# EAGLE design Legoduino (EAGLE 6.5.0)
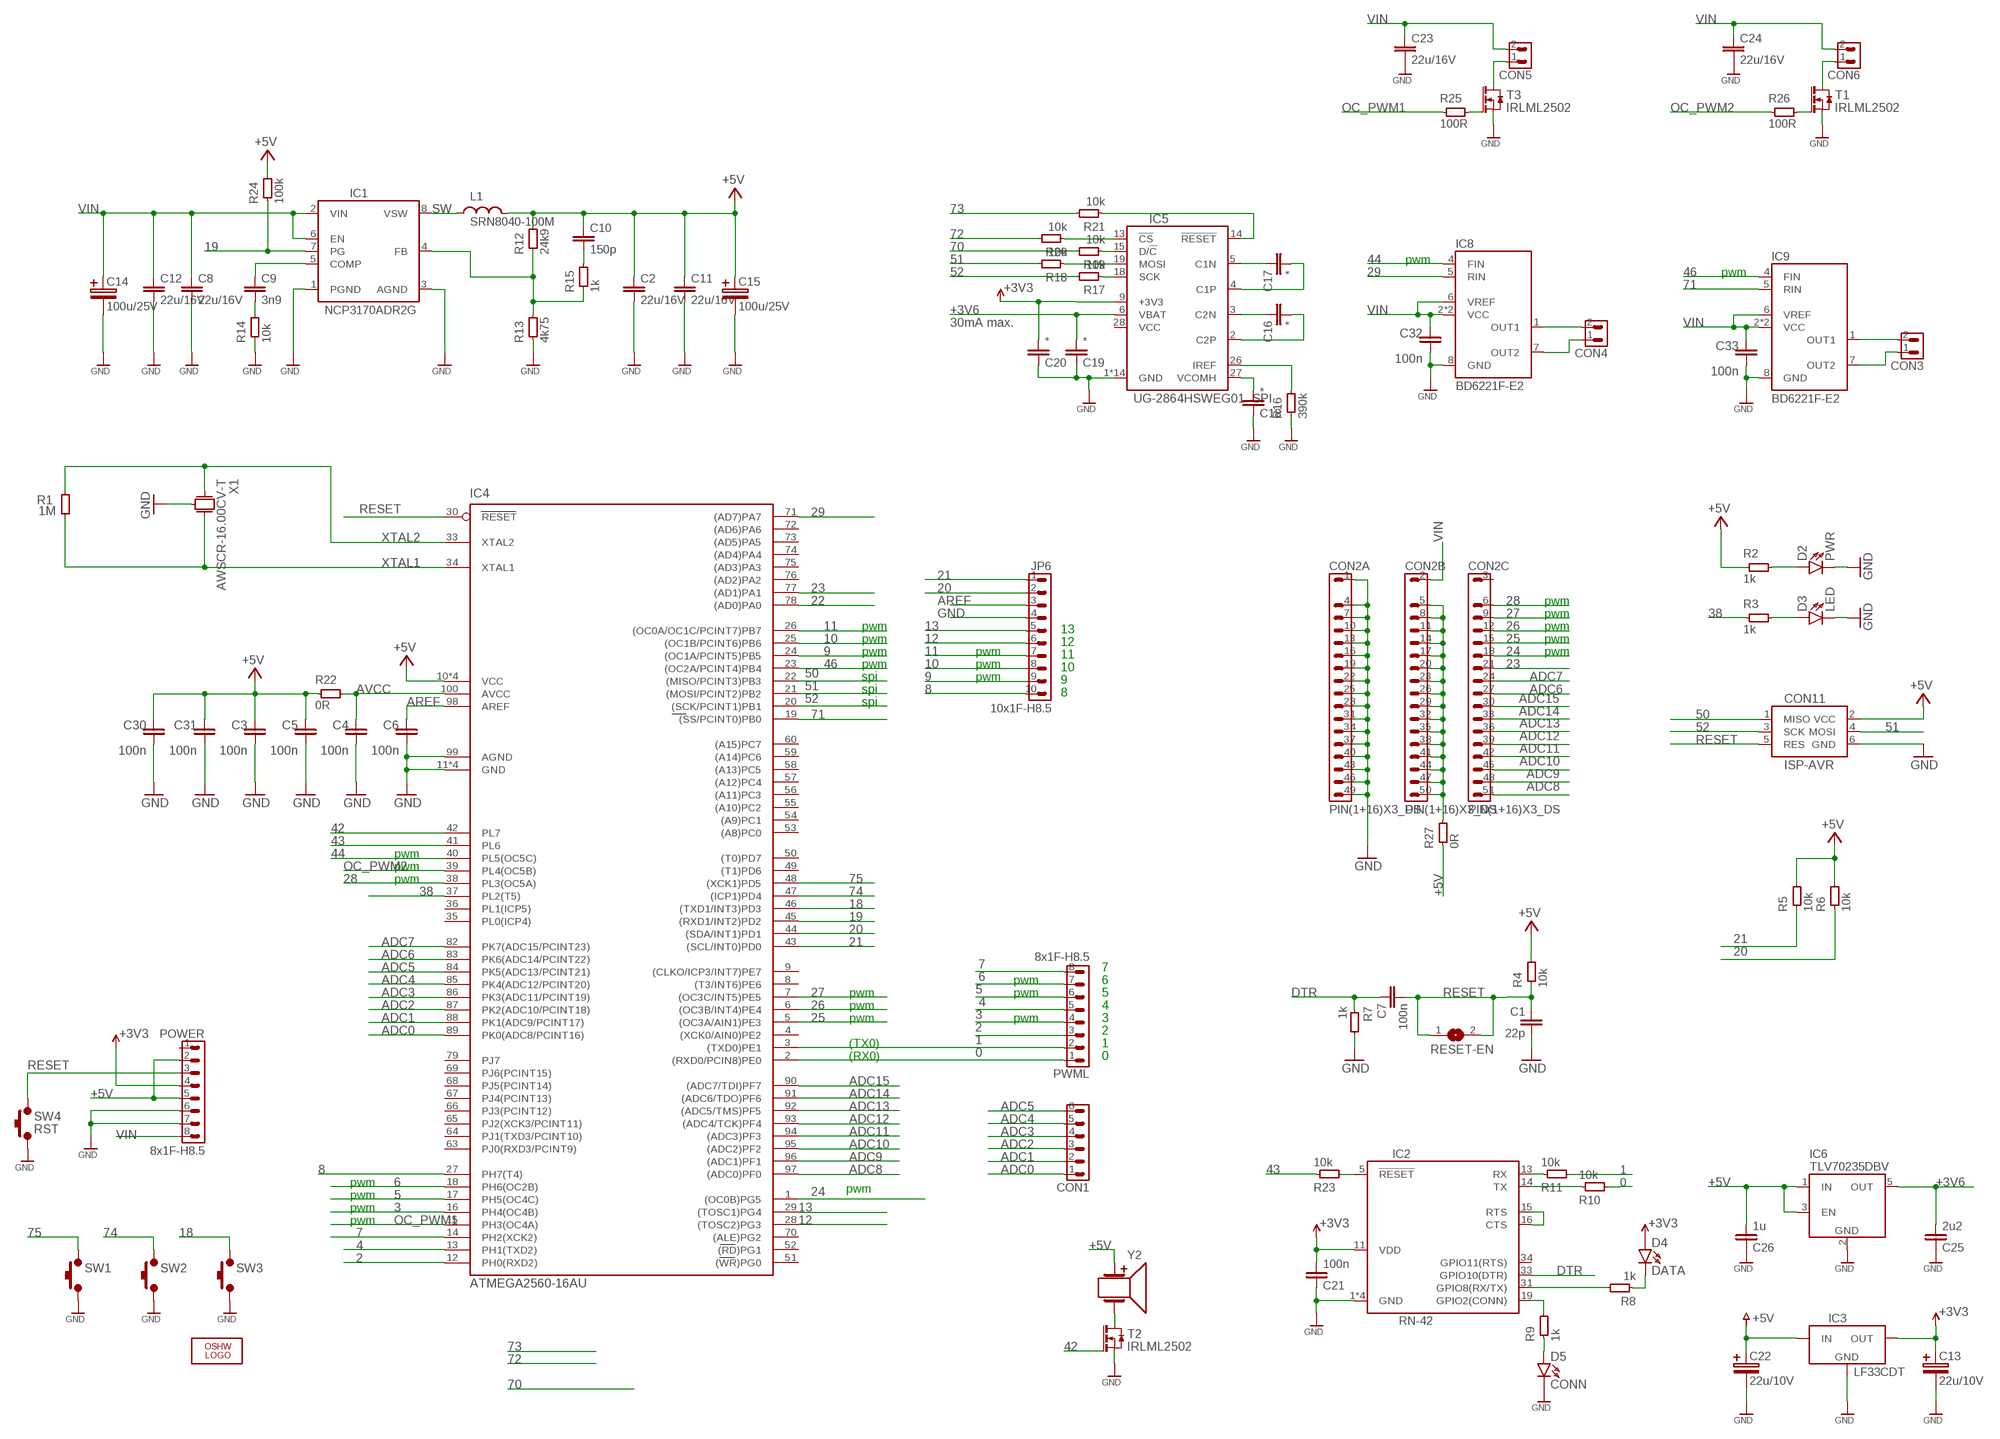
[diagram p0: schematic, sheet 1]

## Parts
C1  22p  C0603  [0603]
C2  22u/16V  C1210  [1210]
C3  100n  C0603  [0603]
C4  100n  C0603  [0603]
C5  100n  C0603  [0603]
C6  100n  C0603  [0603]
C7  100n  C0603  [0603]
C8  22u/16V  C1210  [1210]
C9  3n9  C0603  [0603]
C10  150p  C0603  [0603]
C11  22u/16V  C1210  [1210]
C12  22u/16V  C1210  [1210]
C13  22u/10V  CE-SMC_A  [SMC_A]
C14  100u/25V  CE_SMD6.3  [CE_SMD6.3]
C15  100u/25V  CE_SMD6.3  [CE_SMD6.3]
C16  *  C0603  [0603]
C17  *  C0603  [0603]
C18  *  C0603  [0603]
C19  *  C0603  [0603]
C20  *  C0603  [0603]
C21  100n  C0603  [0603]
C22  22u/10V  CE-SMC_A  [SMC_A]
C23  22u/16V  C1210  [1210]
C24  22u/16V  C1210  [1210]
C25  2u2  C0603  [0603]
C26  1u  C0603  [0603]
C30  100n  C0603  [0603]
C31  100n  C0603  [0603]
C32  100n  C0603  [0603]
C33  100n  C0603  [0603]
CON1  PIN6X1C  [PIN6X1C]
CON2  PIN(1+16)X3_DS  [PIN(1+16)X3_DS]
CON3  PIN2X1C  [PIN2X1C]
CON4  PIN2X1C  [PIN2X1C]
CON5  PIN2X1C  [PIN2X1C]
CON6  PIN2X1C  [PIN2X1C]
CON11  ISP-AVR  [PIN3X2]
D2  PWR  LED0805  [D0805]
D3  LED  LED0805  [D0805]
D4  DATA  LED0805  [D0805]
D5  CONN  LED0805  [D0805]
IC1  NCP3170ADR2G  [SO08]
IC2  RN-42  [RN42]
IC3  LF33CDT  [DPAK]
IC4  ATMEGA2560-16AU  [TQFP100]
IC5  UG-2864HSWEG01_SPI  [UG-2864HSWEG01]
IC6  TLV70235DBV  [SOT23-5]
IC8  BD6221F-E2  [SO08]
IC9  BD6221F-E2  [SO08]
JP6  10x1F-H8.5  PIN10X1C  [PIN10X1C]
L1  SRN8040-100M  [SRN8040]
LOGO1  OSHW_LOGO_10MILX0200-NT  [OSHW_10X200_NOTEXT]
POWER  8x1F-H8.5  PIN8X1C  [PIN8X1C]
PWML  8x1F-H8.5  PIN8X1C  [PIN8X1C]
R1  1M  R0603  [0603]
R2  1k  R0603  [0603]
R3  1k  R0603  [0603]
R4  10k  R0603  [0603]
R5  10k  R0603  [0603]
R6  10k  R0603  [0603]
R7  1k  R0603  [0603]
R8  1k  R0603  [0603]
R9  1k  R0603  [0603]
R10  10k  R0603  [0603]
R11  10k  R0603  [0603]
R12  24k9  R0603  [0603]
R13  4k75  R0603  [0603]
R14  10k  R0603  [0603]
R15  1k  R0603  [0603]
R16  390k  R0603  [0603]
R17  10k  R0603  [0603]
R18  10k  R0603  [0603]
R19  10k  R0603  [0603]
R20  10k  R0603  [0603]
R21  10k  R0603  [0603]
R22  0R  R0603  [0603]
R23  10k  R0603  [0603]
R24  100k  R0603  [0603]
R25  100R  R0603  [0603]
R26  100R  R0603  [0603]
R27  0R  R0805  [0805]
RESET-EN  SJ  [SJ]
SW1  SW_SMD  [MICROSW_SMD]
SW2  SW_SMD  [MICROSW_SMD]
SW3  SW_SMD  [MICROSW_SMD]
SW4  RST  SW_SMD  [MICROSW_SMD]
T1  IRLML2502  [SOT23]
T2  IRLML2502  [SOT23]
T3  IRLML2502  [SOT23]
X1  AWSCR-16.00CV-T  [CERAMIC_3.7X3.1]
Y2  BUZZER-HCM  [BUZZER-HCM]

## Nets
0: IC4.2((RXD0/PCIN8)PE0) PWML.1 R10.2
1: IC4.3((TXD0)PE1) PWML.2 R11.2
2: IC4.12(PH0(RXD2)) PWML.3
3: IC4.16(PH4(OC4B)) PWML.4
4: IC4.13(PH1(TXD2)) PWML.5
5: IC4.17(PH5(OC4C)) PWML.6
6: IC4.18(PH6(OC2B)) PWML.7
7: IC4.14(PH2(XCK2)) PWML.8
8: IC4.27(PH7(T4)) JP6.10
9: IC4.24((OC1A/PCINT5)PB5) JP6.9
10: IC4.25((OC1B/PCINT6)PB6) JP6.8
11: IC4.26((OC0A/OC1C/PCINT7)PB7) JP6.7
12: IC4.28((TOSC2)PG3) JP6.6
13: IC4.29((TOSC1)PG4) JP6.5
18: IC4.46((TXD1/INT3)PD3) SW3.1 SW3.1A
19: IC1.7(PG) IC4.45((RXD1/INT2)PD2) R24.1
20: IC4.44((SDA/INT1)PD1) JP6.2 R6.1
21: IC4.43((SCL/INT0)PD0) JP6.1 R5.1
22: IC4.78((AD0)PA0)
23: CON2.21 IC4.77((AD1)PA1)
24: CON2.18 IC4.1((OC0B)PG5)
25: CON2.15 IC4.5((OC3A/AIN1)PE3)
26: CON2.12 IC4.6((OC3B/INT4)PE4)
27: CON2.9 IC4.7((OC3C/INT5)PE5)
28: CON2.6 IC4.38(PL3(OC5A))
29: IC4.71((AD7)PA7) IC8.5(RIN)
38: IC4.37(PL2(T5)) R3.1
42: IC4.42(PL7) T2.1(G)
43: IC4.41(PL6) R23.1
44: IC4.40(PL5(OC5C)) IC8.4(FIN)
46: IC4.23((OC2A/PCINT4)PB4) IC9.4(FIN)
50: CON11.1(MISO) IC4.22((MISO/PCINT3)PB3)
51: CON11.4(MOSI) IC4.21((MOSI/PCINT2)PB2) R18.2
52: CON11.3(SCK) IC4.20((SCK/PCINT1)PB1) R17.2
70: R19.2
71: IC4.19((SS/PCINT0)PB0) IC9.5(RIN)
72: R20.2
73: R21.2
74: IC4.47((ICP1)PD4) SW2.1 SW2.1A
75: IC4.48((XCK1)PD5) SW1.1 SW1.1A
+3V3: C13.+ C20.2 C21.2 D4.A IC2.11(VDD) IC3.3(OUT) IC5.9(+3V3) POWER.4
+3V6: C19.2 C25.2 IC5.6(VBAT) IC6.5(OUT)
+5V: C2.1 C3.1 C5.1 C10.1 C11.1 C15.+ C22.+ C26.2 C30.1 C31.1 CON11.2(VCC) IC3.1(IN) IC4.10(VCC) IC4.31(VCC) IC4.61(VCC) IC4.80(VCC) IC6.1(IN) IC6.3(EN) L1.2 POWER.2 POWER.5 R2.1 R4.2 R5.2 R6.2 R12.2 R22.1 R24.2 R27.1 Y2.+
+5VP_O: CON2.5 CON2.8 CON2.11 CON2.14 CON2.17 CON2.20 CON2.23 CON2.26 CON2.29 CON2.32 CON2.35 CON2.38 CON2.41 CON2.44 CON2.47 CON2.50 R27.2
ADC0: CON1.1 IC4.89(PK0(ADC8/PCINT16))
ADC1: CON1.2 IC4.88(PK1(ADC9/PCINT17))
ADC2: CON1.3 IC4.87(PK2(ADC10/PCINT18))
ADC3: CON1.4 IC4.86(PK3(ADC11/PCINT19))
ADC4: CON1.5 IC4.85(PK4(ADC12/PCINT20))
ADC5: CON1.6 IC4.84(PK5(ADC13/PCINT21))
ADC6: CON2.27 IC4.83(PK6(ADC14/PCINT22))
ADC7: CON2.24 IC4.82(PK7(ADC15/PCINT23))
ADC8: CON2.51 IC4.97((ADC0)PF0)
ADC9: CON2.48 IC4.96((ADC1)PF1)
ADC10: CON2.45 IC4.95((ADC2)PF2)
ADC11: CON2.42 IC4.94((ADC3)PF3)
ADC12: CON2.39 IC4.93((ADC4/TCK)PF4)
ADC13: CON2.36 IC4.92((ADC5/TMS)PF5)
ADC14: CON2.33 IC4.91((ADC6/TDO)PF6)
ADC15: CON2.30 IC4.90((ADC7/TDI)PF7)
AREF: C6.1 IC4.98(AREF) JP6.3
AVCC: C4.1 IC4.100(AVCC) R22.2
DTR: C7.1 IC2.33(GPIO10(DTR)) R7.1
GND: C1.2 C2.2 C3.2 C4.2 C5.2 C6.2 C8.2 C11.2 C12.2 C13.- C14.- C15.- C18.1 C19.1 C20.1 C21.1 C22.- C23.2 C24.2 C25.1 C26.1 C30.2 C31.2 C32.2 C33.2 CON2.1 CON2.4 CON2.7 CON2.10 CON2.13 CON2.16 CON2.19 CON2.22 CON2.25 CON2.28 CON2.31 CON2.34 CON2.37 CON2.40 CON2.43 CON2.46 CON2.49 CON11.6(GND) D2.K D3.K D5.K IC1.1(PGND) IC1.3(AGND) IC2.1(GND) IC2.12(GND) IC2.28(GND) IC2.29(GND) IC3.2(GND) IC4.11(GND) IC4.32(GND) IC4.62(GND) IC4.81(GND) IC4.99(AGND) IC5.1(GND) IC5.8(GND) IC5.10(GND) IC5.11(GND) IC5.12(GND) IC5.16(GND) IC5.17(GND) IC5.21(GND) IC5.22(GND) IC5.23(GND) IC5.24(GND) IC5.25(GND) IC5.29(GND) IC5.30(GND) IC6.2(GND) IC8.8(GND) IC9.8(GND) JP6.4 POWER.6 POWER.7 R7.2 R13.1 R14.1 R16.1 SW1.2 SW1.2A SW2.2 SW2.2A SW3.2 SW3.2A SW4.2 SW4.2A T1.2(S) T2.2(S) T3.2(S) X1.0
GND1: IC1.4(FB) R12.1 R13.2 R15.1
N$1: IC2.14(TX) R10.1
N$2: D3.A R3.2
N$3: D2.A R2.2
N$4: IC2.13(RX) R11.1
N$5: IC2.31(GPIO8(RX/TX)) R8.2
N$6: D4.K R8.1
N$7: D5.A R9.1
N$8: IC2.19(GPIO2(CONN)) R9.2
N$9: C18.2 IC5.27(VCOMH)
N$10: C9.1 IC1.5(COMP)
N$11: C9.2 R14.2
N$12: IC5.26(IREF) R16.2
N$13: C10.2 R15.2
N$14: C16.1 IC5.3(C2N)
N$15: C17.2 IC5.4(C1P)
N$16: C16.2 IC5.2(C2P)
N$17: C17.1 IC5.5(C1N)
N$18: IC5.13(!CS) R20.1
N$19: IC5.15(D/!C) R19.1
N$20: IC5.18(SCK) R17.1
N$21: IC5.19(MOSI) R18.1
N$22: IC2.15(RTS) IC2.16(CTS)
N$23: IC5.14(!RESET) R21.1
N$24: R25.2 T3.1(G)
N$25: T2.3(D) Y2.-
N$26: CON5.1 T3.3(D)
N$27: IC2.5(!RESET) R23.2
N$28: R26.2 T1.1(G)
N$29: CON3.2 IC9.1(OUT1)
N$30: CON4.2 IC8.1(OUT1)
N$31: CON6.1 T1.3(D)
N$32: CON3.1 IC9.7(OUT2)
N$33: CON4.1 IC8.7(OUT2)
OC_PWM1: IC4.15(PH3(OC4A)) R25.1
OC_PWM2: IC4.39(PL4(OC5B)) R26.1
RESET: C1.1 C7.2 CON11.5(RES) IC4.30(RESET) POWER.3 R4.1 RESET-EN.1 RESET-EN.2 SW4.1 SW4.1A
SW: IC1.8(VSW) L1.1
VIN: C8.1 C12.1 C14.+ C23.1 C24.1 C32.1 C33.1 CON2.2 CON5.2 CON6.2 IC1.2(VIN) IC1.6(EN) IC8.2(VCC) IC8.3(VCC) IC8.6(VREF) IC9.2(VCC) IC9.3(VCC) IC9.6(VREF) POWER.8
XTAL1: IC4.34(XTAL1) R1.1 X1.2
XTAL2: IC4.33(XTAL2) R1.2 X1.1
Unconnected: CON2.3 IC2.34(GPIO11(RTS)) IC4.4((XCK0/AIN0)PE2) IC4.8((T3/INT6)PE6) IC4.9((CLKO/ICP3/INT7)PE7) IC4.35(PL0(ICP4)) IC4.36(PL1(ICP5)) IC4.49((T1)PD6) IC4.50((T0)PD7) IC4.51((WR)PG0) IC4.52((RD)PG1) IC4.53((A8)PC0) IC4.54((A9)PC1) IC4.55((A10)PC2) IC4.56((A11)PC3) IC4.57((A12)PC4) IC4.58((A13)PC5) IC4.59((A14)PC6) IC4.60((A15)PC7) IC4.63(PJ0(RXD3/PCINT9)) IC4.64(PJ1(TXD3/PCINT10)) IC4.65(PJ2(XCK3/PCINT11)) IC4.66(PJ3(PCINT12)) IC4.67(PJ4(PCINT13)) IC4.68(PJ5(PCINT14)) IC4.69(PJ6(PCINT15)) IC4.70((ALE)PG2) IC4.72((AD6)PA6) IC4.73((AD5)PA5) IC4.74((AD4)PA4) IC4.75((AD3)PA3) IC4.76((AD2)PA2) IC4.79(PJ7) POWER.1

## Notes on the sheet
- pwm
- pwm
- 30mA max.
- pwm
- pwm
- pwm | 13 | pwm
- pwm | 12 | pwm
- pwm | pwm | 11 | pwm
- pwm | pwm | 10
- spi | pwm | 9
- spi | 8
- spi
- pwm
- pwm
- pwm
- 7
- pwm | 6
- pwm | pwm | 5
- pwm | 4
- pwm | pwm | 3
- 2
- (TX0) | 1
- (RX0) | 0
- pwm
- pwm
- pwm
- pwm
- pwm

## Power pins joined to a net without a drawn wire
VCC: IC5.28(VCC)

## Library data of the parts
C1-C12 C16-C21 C23-C26 C30-C33 = PN_default:C
C13 C22 = Pietrucha:CE: kondensator elektrolityczny
C14 C15 = PN_default:CE: kondensator elektrolityczny
CON1 = pins:PIN6X1
CON2 = PN_connector:PIN(1+16)X3
CON3-CON6 = pins:PIN2X1
CON11 = Pietrucha:ISP-AVR
D2-D5 = PN_default:LED
IC1 = PN_IC:NCP3170
IC2 = PN_modules:RN-42
IC3 = PN_LDO:LF*: LDO Vin = 2.5-16V Iout = 1A Iq = 1mA max. @ Il=0 1.5V droput max. Needs minimum 2uF (opt. 10uF) Cout with ESR=0.1-10Ohm; VOUT: 3.3V
IC4 = PN_microcontrollers:ATMEGA2560: MICROCONTROLLER 256 Kbytes FLASH 4 Kbytes EEPROM 8 Kbytes SRAM 86 General Purpose I/O pins 12-channels16-bit PWM 4 x Serial USARTs 16-channels 10-bit A/D
IC5 = PN_opto:UG-2864HSWEG01_SPI
IC6 = PN_LDO:TLV702*: LDO Vin = 2-5.5V Iout = 300mA Iq = 2uA max. in shutdown Iq = 55uA max. @ Il=0 375mV droput max. Stable with 2*1uF ceramic capacitors; I_MAX: 300mA; VIN_MAX: 5.5V; VOUT: 3.5V
IC8 IC9 = PN_IC:BD6221
JP6 = pins:PIN10X1
L1 = PN_inductor:SRN8040
LOGO1 = ohw-logo:OSHW_LOGO_10MIL
POWER PWML = pins:PIN8X1
R1-R27 = PN_default:R
RESET-EN = jumper:SJ: SMD solder JUMPER
SW1-SW4 = PN_default:SW
T1-T3 = PN_mosfet:IRLML2502
X1 = PN_quartz:AWSCR: Ceramic resonator
Y2 = Pietrucha:BUZZER

## Board
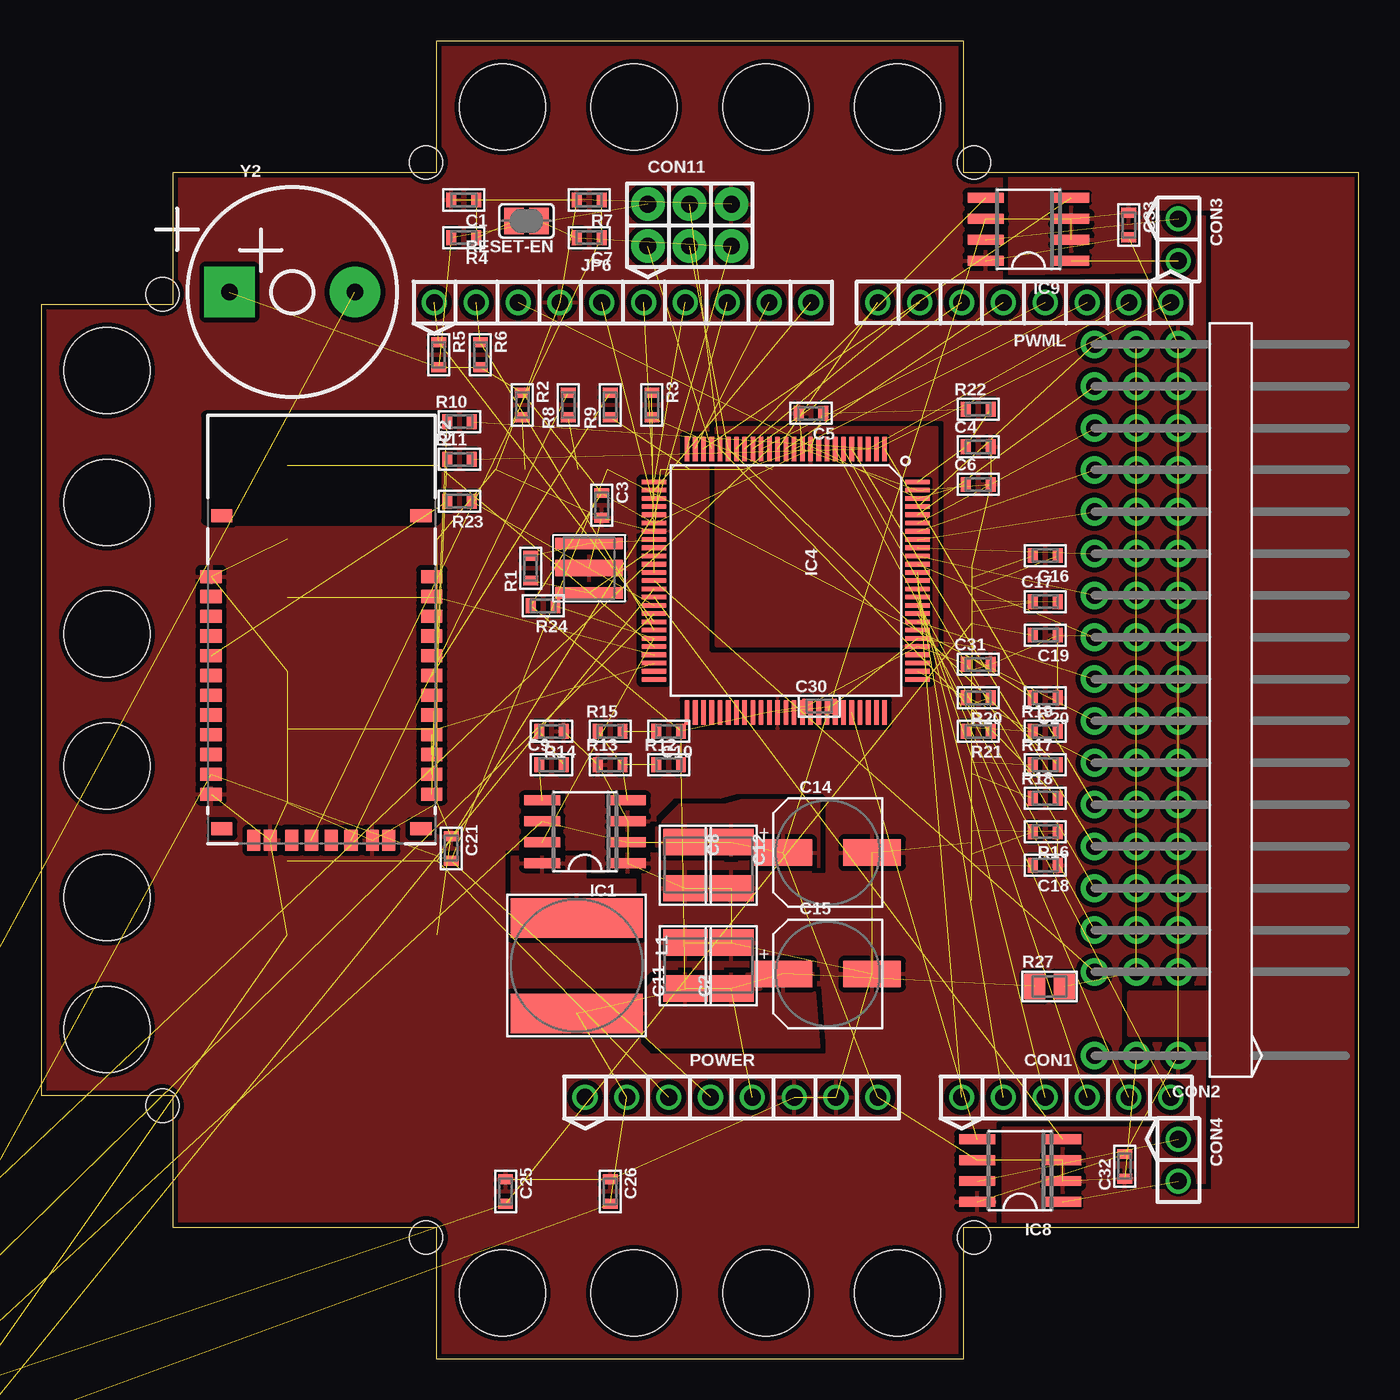
[diagram p1: board, top side]
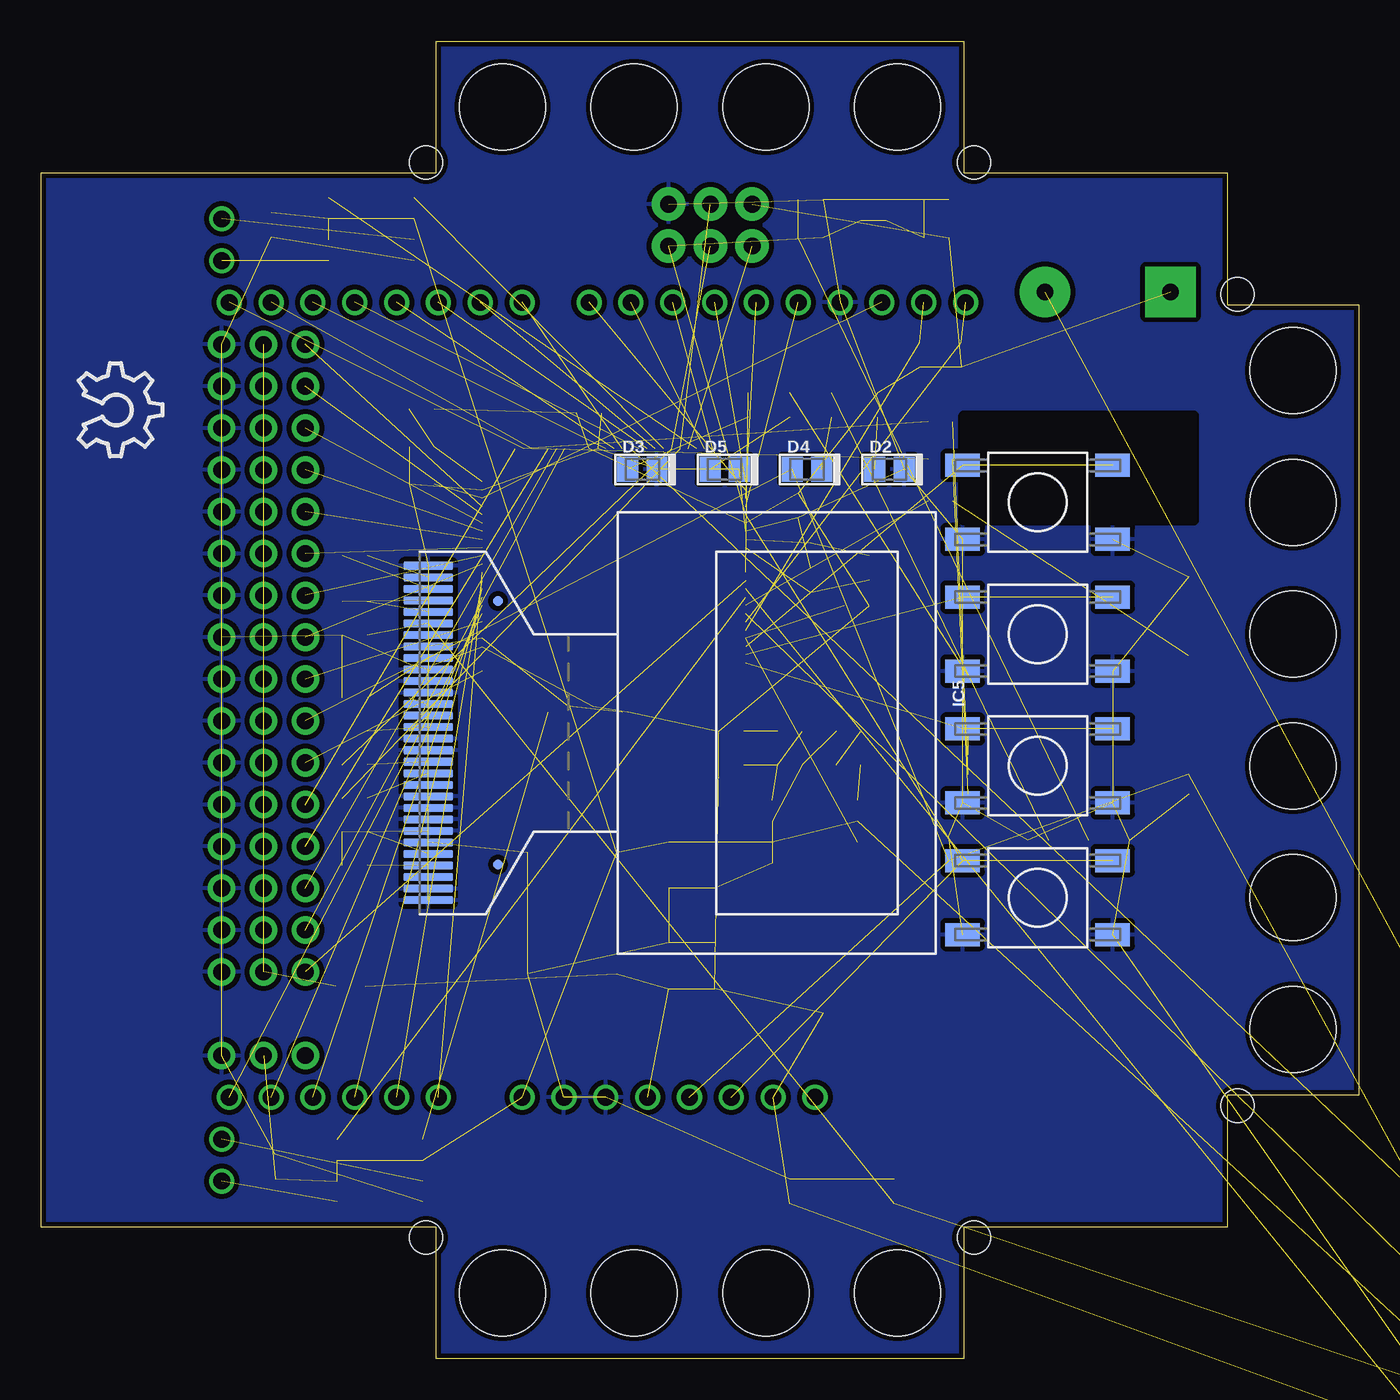
[diagram p2: board, bottom side, seen from below]

Size 80 x 80 mm. Coordinates in mm from the lower left corner, seen from the top.
Outline: 0,16 8,16 8,8 24,8 24,0 56,0 56,8 80,8 80,72 56,72 56,80 24,80 24,72 8,72 8,64 0,64 0,16
Copper layers (1*16): Top 0.035mm / dielectric 1.5mm / Bottom 0.035mm
Design rules "SeeedStudio_v1.1 *": minimum track width 6mil, minimum drill 12mil, track to track 6mil, track to pad 6mil, pad to pad 6mil, via to via 6mil, smd to smd 0mil, copper to edge 10mil, drill to drill 10mil, minimum pad ring 10mil, minimum via ring 6mil, stop-mask expansion 2mil, vias tented up to drill 100mil, thermal gap 12mil
Holes 2 mm at 7.37,64.64 23.36,72.64 56.63,72.64 56.63,7.37 23.36,7.37 7.37,15.37
Holes 5.2 mm at 28,4 36,4 44,4 52,4 4,20 4,28 4,36 4,44 4,52 4,60 28,76 36,76 44,76 52,76
tKeepout: area 24,0 to 56,8; area 24,72 to 56,80
bKeepout: area 24,72 to 56,80; area 24,0 to 56,8

### Footprints (pad centres in the part's own frame; a part is rotated, then mirrored left to right if it is on the bottom)
0603 = smd 0.6 x 0.9: 1 -0.75,0; 2 0.75,0
1210 = smd 1.6 x 2.7: 1 -1.4,0; 2 1.4,0
SMC_A = smd 1.6 x 1.4: + -1.5,0; - 1.5,0
CE_SMD6.3 = smd 3.5 x 1.6: + -2.7,0; - 2.7,0
PIN6X1C = drill 1.016 pad 1.524: 1 -6.35,0; 2 -3.81,0; 3 -1.27,0; 4 1.27,0; 5 3.81,0; 6 6.35,0
PIN(1+16)X3_DS = drill 1.016 pad 1.676: 1 -21.59,-2.54; 2 -21.59,0; 3 -21.59,2.54; 4 -16.51,-2.54; 5 -16.51,0; 6 -16.51,2.54; 7 -13.97,-2.54; 8 -13.97,0; 9 -13.97,2.54; 10 -11.43,-2.54; 11 -11.43,0; 12 -11.43,2.54; 13 -8.89,-2.54; 14 -8.89,0; 15 -8.89,2.54; 16 -6.35,-2.54; 17 -6.35,0; 18 -6.35,2.54; 19 -3.81,-2.54; 20 -3.81,0; 21 -3.81,2.54; 22 -1.27,-2.54; 23 -1.27,0; 24 -1.27,2.54; 25 1.27,-2.54; 26 1.27,0; 27 1.27,2.54; 28 3.81,-2.54; 29 3.81,0; 30 3.81,2.54; 31 6.35,-2.54; 32 6.35,0; 33 6.35,2.54; 34 8.89,-2.54; 35 8.89,0; 36 8.89,2.54; 37 11.43,-2.54; 38 11.43,0; 39 11.43,2.54; 40 13.97,-2.54; 41 13.97,0; 42 13.97,2.54; 43 16.51,-2.54; 44 16.51,0; 45 16.51,2.54; 46 19.05,-2.54; 47 19.05,0; 48 19.05,2.54; 49 21.59,-2.54; 50 21.59,0; 51 21.59,2.54
PIN2X1C = drill 1.016 pad 1.524: 1 -1.27,0; 2 1.27,0
PIN3X2 = drill 1.016 pad 2.032: 1 -2.54,-1.27; 2 -2.54,1.27; 3 0,-1.27; 4 0,1.27; 5 2.54,-1.27; 6 2.54,1.27
D0805 = smd 1.27 x 1.524: A -0.889,0; K 0.889,0
SO08 = smd 0.6 x 2.2: 1 -1.905,-2.6; 2 -0.635,-2.6; 3 0.635,-2.6; 4 1.905,-2.6; 5 1.905,2.6; 6 0.635,2.6; 7 -0.635,2.6; 8 -1.905,2.6
RN42 = smd 0.8 x 1.3: 1 -3.2,-6.7; 2 -2,-6.7; 3 -0.8,-6.7; 4 0.4,-6.7; 5 1.6,-6.7; 6 2.8,-6.7; 7 4,-6.7; 8 5.2,-6.7; 9 6.4,-6.7; 10 7.6,-6.7; 11 8.8,-6.7; 12 10,-6.7; 13 10,6.7; 14 8.8,6.7; 15 7.6,6.7; 16 6.4,6.7; 17 5.2,6.7; 18 4,6.7; 19 2.8,6.7; 20 1.6,6.7; 21 0.4,6.7; 22 -0.8,6.7; 23 -2,6.7; 24 -3.2,6.7; P$1 12.1,6.05; P$10 12.1,-6.05; P$35 -6.9,-6.05; P$36 -6.9,6.05 | smd 1.3 x 0.78: 28 12.8,3.1; 29 12.8,-3.1; 30 12.8,4.1; 35 12.8,-4.1 | smd 1.3 x 0.8: 31 12.8,1.8; 32 12.8,0.6; 33 12.8,-0.6; 34 12.8,-1.8
DPAK = smd 1.6 x 3: 1 -2.3,-3.3; 3 2.3,-3.3 | smd 6.7 x 6.7: 2 0,3.35
TQFP100 = smd 1.5 x 0.28: 1 -8,6; 2 -8,5.5; 3 -8,5; 4 -8,4.5; 5 -8,4; 6 -8,3.5; 7 -8,3; 8 -8,2.5; 9 -8,2; 10 -8,1.5; 11 -8,1; 12 -8,0.5; 13 -8,0; 14 -8,-0.5; 15 -8,-1; 16 -8,-1.5; 17 -8,-2; 18 -8,-2.5; 19 -8,-3; 20 -8,-3.5; 21 -8,-4; 22 -8,-4.5; 23 -8,-5; 24 -8,-5.5; 25 -8,-6; 51 8,-6; 52 8,-5.5; 53 8,-5; 54 8,-4.5; 55 8,-4; 56 8,-3.5; 57 8,-3; 58 8,-2.5; 59 8,-2; 60 8,-1.5; 61 8,-1; 62 8,-0.5; 63 8,0; 64 8,0.5; 65 8,1; 66 8,1.5; 67 8,2; 68 8,2.5; 69 8,3; 70 8,3.5; 71 8,4; 72 8,4.5; 73 8,5; 74 8,5.5; 75 8,6 | smd 0.28 x 1.5: 26 -6,-8; 27 -5.5,-8; 28 -5,-8; 29 -4.5,-8; 30 -4,-8; 31 -3.5,-8; 32 -3,-8; 33 -2.5,-8; 34 -2,-8; 35 -1.5,-8; 36 -1,-8; 37 -0.5,-8; 38 0,-8; 39 0.5,-8; 40 1,-8; 41 1.5,-8; 42 2,-8; 43 2.5,-8; 44 3,-8; 45 3.5,-8; 46 4,-8; 47 4.5,-8; 48 5,-8; 49 5.5,-8; 50 6,-8; 76 6,8; 77 5.5,8; 78 5,8; 79 4.5,8; 80 4,8; 81 3.5,8; 82 3,8; 83 2.5,8; 84 2,8; 85 1.5,8; 86 1,8; 87 0.5,8; 88 0,8; 89 -0.5,8; 90 -1,8; 91 -1.5,8; 92 -2,8; 93 -2.5,8; 94 -3,8; 95 -3.5,8; 96 -4,8; 97 -4.5,8; 98 -5,8; 99 -5.5,8; 100 -6,8
UG-2864HSWEG01 = smd 0.45 x 3: 1 -10.15,-23; 2 -9.45,-23; 3 -8.75,-23; 4 -8.05,-23; 5 -7.35,-23; 6 -6.65,-23; 7 -5.95,-23; 8 -5.25,-23; 9 -4.55,-23; 10 -3.85,-23; 11 -3.15,-23; 12 -2.45,-23; 13 -1.75,-23; 14 -1.05,-23; 15 -0.35,-23; 16 0.35,-23; 17 1.05,-23; 18 1.75,-23; 19 2.45,-23; 20 3.15,-23; 21 3.85,-23; 22 4.55,-23; 23 5.25,-23; 24 5.95,-23; 25 6.65,-23; 26 7.35,-23; 27 8.05,-23; 28 8.75,-23; 29 9.45,-23; 30 10.15,-23 | smd 0.6 x 0.6: ALIGN1 -8,-18.75; ALIGN2 8,-18.75
SOT23-5 = smd 0.7 x 1: 1 -0.95,-1.3; 2 0,-1.3; 3 0.95,-1.3; 4 0.95,1.3; 5 -0.95,1.3
PIN10X1C = drill 1.016 pad 1.524: 1 -11.43,0; 2 -8.89,0; 3 -6.35,0; 4 -3.81,0; 5 -1.27,0; 6 1.27,0; 7 3.81,0; 8 6.35,0; 9 8.89,0; 10 11.43,0
SRN8040 = smd 2.4 x 8: 1 -2.9,0; 2 2.9,0
PIN8X1C = drill 1.016 pad 1.524: 1 -8.89,0; 2 -6.35,0; 3 -3.81,0; 4 -1.27,0; 5 1.27,0; 6 3.81,0; 7 6.35,0; 8 8.89,0
0805 = smd 1.27 x 1.524: 1 -0.889,0; 2 0.889,0
SJ = smd 1.168 x 1.6: 1 -0.762,0; 2 0.762,0
MICROSW_SMD = smd 1.4 x 2.1: 1 -2.25,-4.55; 1A -2.25,4.55; 2 2.25,-4.55; 2A 2.25,4.55
SOT23 = smd 1 x 1.4: 1 -0.95,-1.1; 2 0.95,-1.1; 3 0,1.1
CERAMIC_3.7X3.1 = smd 1 x 4.1: 0 0,0 | smd 0.7 x 4.1: 1 -1.5,0; 2 1.5,0
BUZZER-HCM = drill 1.016 pad 3.048 square: + -3.81,0 | drill 1.016 pad 3.048: - 3.81,0

### Placement (x,y rotation side)
C1  25.65,70.36 180 top
C2  41.91,23.88 90 top
C3  34.04,51.82 270 top
C4  56.9,55.37 0 top
C5  46.74,57.4 180 top
C6  56.9,53.09 0 top
C7  33.27,68.07 180 top
C8  39.12,29.97 270 top
C9  30.99,36.07 0 top
C10  38.1,38.1 180 top
C11  39.12,23.88 90 top
C12  41.91,29.97 270 top
C13  -17.02,-9.65 0 top  (outside the outline)
C14  47.75,30.73 0 top
C15  47.75,23.37 0 top
C16  60.96,48.77 180 top
C17  60.96,45.97 0 top
C18  60.96,29.97 180 top
C19  60.96,43.94 180 top
C20  60.96,40.13 180 top
C21  24.89,30.99 270 top
C22  -17.02,-14.48 0 top  (outside the outline)
C23  -38.35,-22.86 0 top  (outside the outline)
C24  -38.35,-35.56 0 top  (outside the outline)
C25  28.19,10.16 270 top
C26  34.54,10.16 270 top
C30  47.24,39.62 0 top
C31  56.9,42.16 0 top
C32  65.79,11.68 90 top
C33  66.04,68.83 270 top
CON1  62.23,15.88 0 top
CON2  66.5,40 90 top
CON3  69.04,67.94 270 top
CON4  69.04,12.06 270 top
CON5  -32.26,-23.88 0 top  (outside the outline)
CON6  -37.85,-42.42 0 top  (outside the outline)
CON11  39.37,68.83 0 top
D2  28.5,54 0 bottom
D3  43.5,54 0 bottom
D4  33.5,54 0 bottom
D5  38.5,54 0 bottom
IC1  33.02,32 90 top
IC2  17.01,44.29 270 top
IC3  -14.48,-2.29 0 top  (outside the outline)
IC4  45.21,47.24 270 top
IC5  33.5,38 270 bottom
IC6  -6.86,-4.06 0 top  (outside the outline)
IC8  59.44,11.43 90 top
IC9  59.94,68.58 90 top
JP6  35.31,64.14 0 top
L1  32.51,23.88 270 top
LOGO1  77.72,60.45 270 bottom
POWER  41.91,15.88 0 top
PWML  59.69,64.14 180 top
R1  29.72,48.01 90 top
R2  29.21,57.91 270 top
R3  37.08,57.91 270 top
R4  25.65,68.07 180 top
R5  24.13,60.96 270 top
R6  26.67,60.96 270 top
R7  33.27,70.36 180 top
R8  32,57.91 90 top
R9  34.54,57.91 90 top
R10  25.4,56.9 0 top
R11  25.4,54.61 0 top
R12  38.1,36.07 0 top
R13  34.54,36.07 0 top
R14  30.99,38.1 180 top
R15  34.54,38.1 0 top
R16  60.96,32 180 top
R17  60.96,36.07 0 top
R18  60.96,34.04 0 top
R19  60.96,38.1 0 top
R20  56.9,40.13 180 top
R21  56.9,38.1 180 top
R22  56.9,57.66 0 top
R23  25.4,52.07 180 top
R24  30.48,45.72 180 top
R25  -33.53,-19.05 0 top  (outside the outline)
R26  -33.02,-40.64 0 top  (outside the outline)
R27  61.21,22.61 0 top
RESET-EN  29.46,69.09 180 top
SW1  19.5,36 270 bottom
SW2  19.5,44 270 bottom
SW3  19.5,52 270 bottom
SW4  19.5,28 270 bottom
T1  -38.35,-28.96 0 top  (outside the outline)
T2  -22.61,-13.21 0 top  (outside the outline)
T3  -27.94,-13.21 0 top  (outside the outline)
X1  33.27,48.01 270 top
Y2  15.24,64.77 0 top

### Tracks (layer width: path | path; a pad name or v marks a point on that pad's centre or on a via)
0  (2 unrouted)
1  (2 unrouted)
2  (1 unrouted)
3  (1 unrouted)
4  (1 unrouted)
5  (1 unrouted)
6  (1 unrouted)
7  (1 unrouted)
8  (1 unrouted)
9  (1 unrouted)
10  (1 unrouted)
11  (1 unrouted)
12  (1 unrouted)
13  (1 unrouted)
18  (2 unrouted)
19  (2 unrouted)
20  (2 unrouted)
21  (2 unrouted)
23  (1 unrouted)
24  (1 unrouted)
25  (1 unrouted)
26  (1 unrouted)
27  (1 unrouted)
28  (1 unrouted)
29  (1 unrouted)
38  (1 unrouted)
42  (1 unrouted)
43  (1 unrouted)
44  (1 unrouted)
46  (1 unrouted)
50  (1 unrouted)
51  (2 unrouted)
52  (2 unrouted)
71  (1 unrouted)
74  (2 unrouted)
75  (2 unrouted)
+3V3  (7 unrouted)
+3V6  (3 unrouted)
+5V  (29 unrouted)
  pour Top: 41.02,56.52 54.36,56.52 54.36,43.31 41.02,43.31
  pour Top: 36.45,22.23 37.59,23.37 43.69,23.37 46.86,23.5 47.24,18.92 37.34,18.92 36.45,19.81
+5VP_O  (16 unrouted)
ADC0  (1 unrouted)
ADC1  (1 unrouted)
ADC2  (1 unrouted)
ADC3  (1 unrouted)
ADC4  (1 unrouted)
ADC5  (1 unrouted)
ADC6  (1 unrouted)
ADC7  (1 unrouted)
ADC8  (1 unrouted)
ADC9  (1 unrouted)
ADC10  (1 unrouted)
ADC11  (1 unrouted)
ADC12  (1 unrouted)
ADC13  (1 unrouted)
ADC14  (1 unrouted)
ADC15  (1 unrouted)
AREF  (2 unrouted)
AVCC  (2 unrouted)
DTR  (2 unrouted)
GND  (93 unrouted)
  pour Bottom (isolate 0.305, rank 2): 0,-7.37 89.48,-7.37 89.48,81.03 0,81.03
  pour Top (isolate 0.305, rank 2): -4,84 84,84 84,-4 -4,-4
GND1  (3 unrouted)
N$1  (1 unrouted)
N$2  (1 unrouted)
N$3  (1 unrouted)
N$4  (1 unrouted)
N$5  (1 unrouted)
N$6  (1 unrouted)
N$7  (1 unrouted)
N$8  (1 unrouted)
N$9  (1 unrouted)
N$10  (1 unrouted)
N$11  (1 unrouted)
N$12  (1 unrouted)
N$13  (1 unrouted)
N$14  (1 unrouted)
N$15  (1 unrouted)
N$16  (1 unrouted)
N$17  (1 unrouted)
N$18  (1 unrouted)
N$19  (1 unrouted)
N$20  (1 unrouted)
N$21  (1 unrouted)
N$22  (1 unrouted)
N$23  (1 unrouted)
N$24  (1 unrouted)
N$25  (1 unrouted)
N$26  (1 unrouted)
N$27  (1 unrouted)
N$28  (1 unrouted)
N$29  (1 unrouted)
N$30  (1 unrouted)
N$31  (1 unrouted)
N$32  (1 unrouted)
N$33  (1 unrouted)
OC_PWM1  (1 unrouted)
OC_PWM2  (1 unrouted)
RESET  (9 unrouted)
SW
  pour Top: 28.57,30.48 28.57,25.65 36.07,25.65 36.07,29.08 33.02,29.08 33.02,30.48
VIN  (18 unrouted)
  pour Top: 37.34,31.11 47.24,29.84 47.24,33.78 47.12,33.91 42.55,33.91 41.53,33.66 38.73,33.66 37.34,32.26
  pour Top: 66.04,19.68 71.12,19.68 71.12,10.16 67.31,10.16 67.31,13.97 58.42,13.97 58.42,7.62 80.64,7.62 80.64,72.39 58.8,72.26 58.8,65.91 67.31,66.04 67.31,69.85 71.12,69.85 71.12,22.23 66.04,22.23
XTAL1  (2 unrouted)
XTAL2  (2 unrouted)